# EAGLE schematic badge_flare_sample (EAGLE 9.4.2)
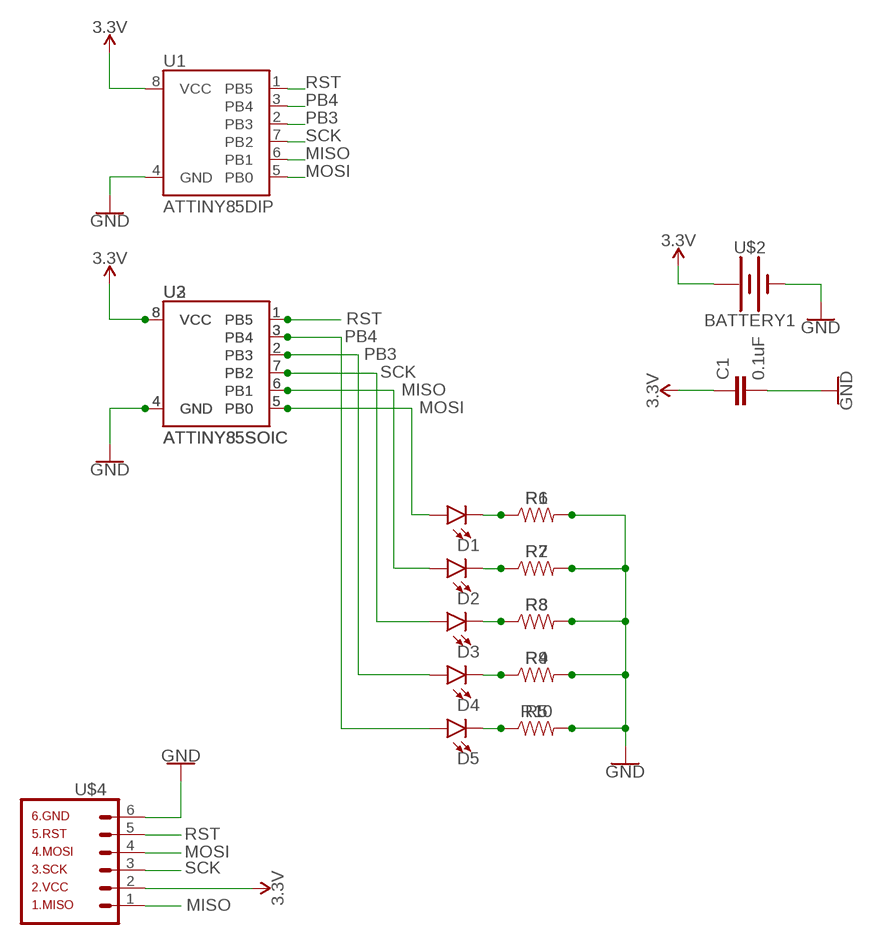
[diagram p0: schematic, sheet 1]

## Parts
C1  0.1uF  0.1UF-KIT-EZ-50V-20%  [CAP-PTH-SMALL-KIT]
D1  LED5MM  [LED_5MM]
D2  LED5MM  [LED_5MM]
D3  LED5MM  [LED_5MM]
D4  LED5MM  [LED_5MM]
D5  LED5MM  [LED_5MM]
R1  RESISTORAXIAL-0.3  [AXIAL-0.3]
R2  RESISTORAXIAL-0.3  [AXIAL-0.3]
R3  RESISTORAXIAL-0.3  [AXIAL-0.3]
R4  RESISTORAXIAL-0.3  [AXIAL-0.3]
R5  RESISTORAXIAL-0.3  [AXIAL-0.3]
R6  RESISTOR0805  [0805]
R7  RESISTOR0805  [0805]
R8  RESISTOR0805  [0805]
R9  RESISTOR0805  [0805]
R10  RESISTOR0805  [0805]
U1  ATTINY85DIP  [DIP08]
U2  ATTINY85SOIC  [ATTINY85]
U3  ATTINY85SOIC  [ATTINY85]
U$2  BATTERY1  [BATTERY_HOLDER_COIN]
U$4  ISP_PROGRAMMER_3MM_PITCH  [1X06-1.27MM-3MM_PITCH_PROGRAMMER]

## Nets
3.3V: C1.1 U1.8(VCC) U2.8(VCC) U3.8(VCC) U$2.1(+) U$4.2(VCC)
GND: C1.2 R1.P$2 R2.P$2 R3.P$2 R4.P$2 R5.P$2 R6.2 R7.2 R8.2 R9.2 R10.2 U1.4(GND) U2.4(GND) U3.4(GND) U$2.2(-) U$4.6(GND)
MISO: D2.A U1.6(PB1) U2.6(PB1) U3.6(PB1) U$4.1(MISO)
MOSI: D1.A U1.5(PB0) U2.5(PB0) U3.5(PB0) U$4.4(MOSI)
N$1: D1.K(C) R1.P$1 R6.1
N$2: D2.K(C) R2.P$1 R7.1
N$3: D3.K(C) R3.P$1 R8.1
N$4: D4.K(C) R4.P$1 R9.1
N$5: D5.K(C) R5.P$1 R10.1
PB3: D4.A U1.2(PB3) U2.2(PB3) U3.2(PB3)
PB4: D5.A U1.3(PB4) U2.3(PB4) U3.3(PB4)
RST: U1.1(PB5) U2.1(PB5) U3.1(PB5) U$4.5(RST)
SCK: D3.A U1.7(PB2) U2.7(PB2) U3.7(PB2) U$4.3(SCK)

## Library data of the parts
C1 = SparkFun-Capacitors:0.1UF: 0.1µF ceramic capacitors A capacitor is a passive two-terminal electrical component used to store electrical energy temporarily in an electric field.; PROD_ID: CAP-08370
D1-D5 = SparkFun-LED:LED: LED (Generic) Standard schematic elements and footprints for 5mm, 3mm, 1206, and 0603 sized LEDs. Generic LEDs with no color specified.
R1-R10 = SparkFun-Resistors:RESISTOR: Generic Resistor Package
U1 = th_libraries:ATTINY85: copied from Sparkfun with SOIC... added throughhole part
U2 U3 = th_libraries:ATTINY85: copied from Sparkfun with SOIC... added throughhole part; PROD_ID: IC-09092
U$2 = th_libraries:BATTERY
U$4 = th_libraries:ISP_PROGRAMMER_3MM_PITCH

## Net classes
1 power: width 0.254 mm